# Altium schematic sheet PLWD_GNSS_RF.SchDoc
size A3; SheetNumber: 4; SheetTotal: 11
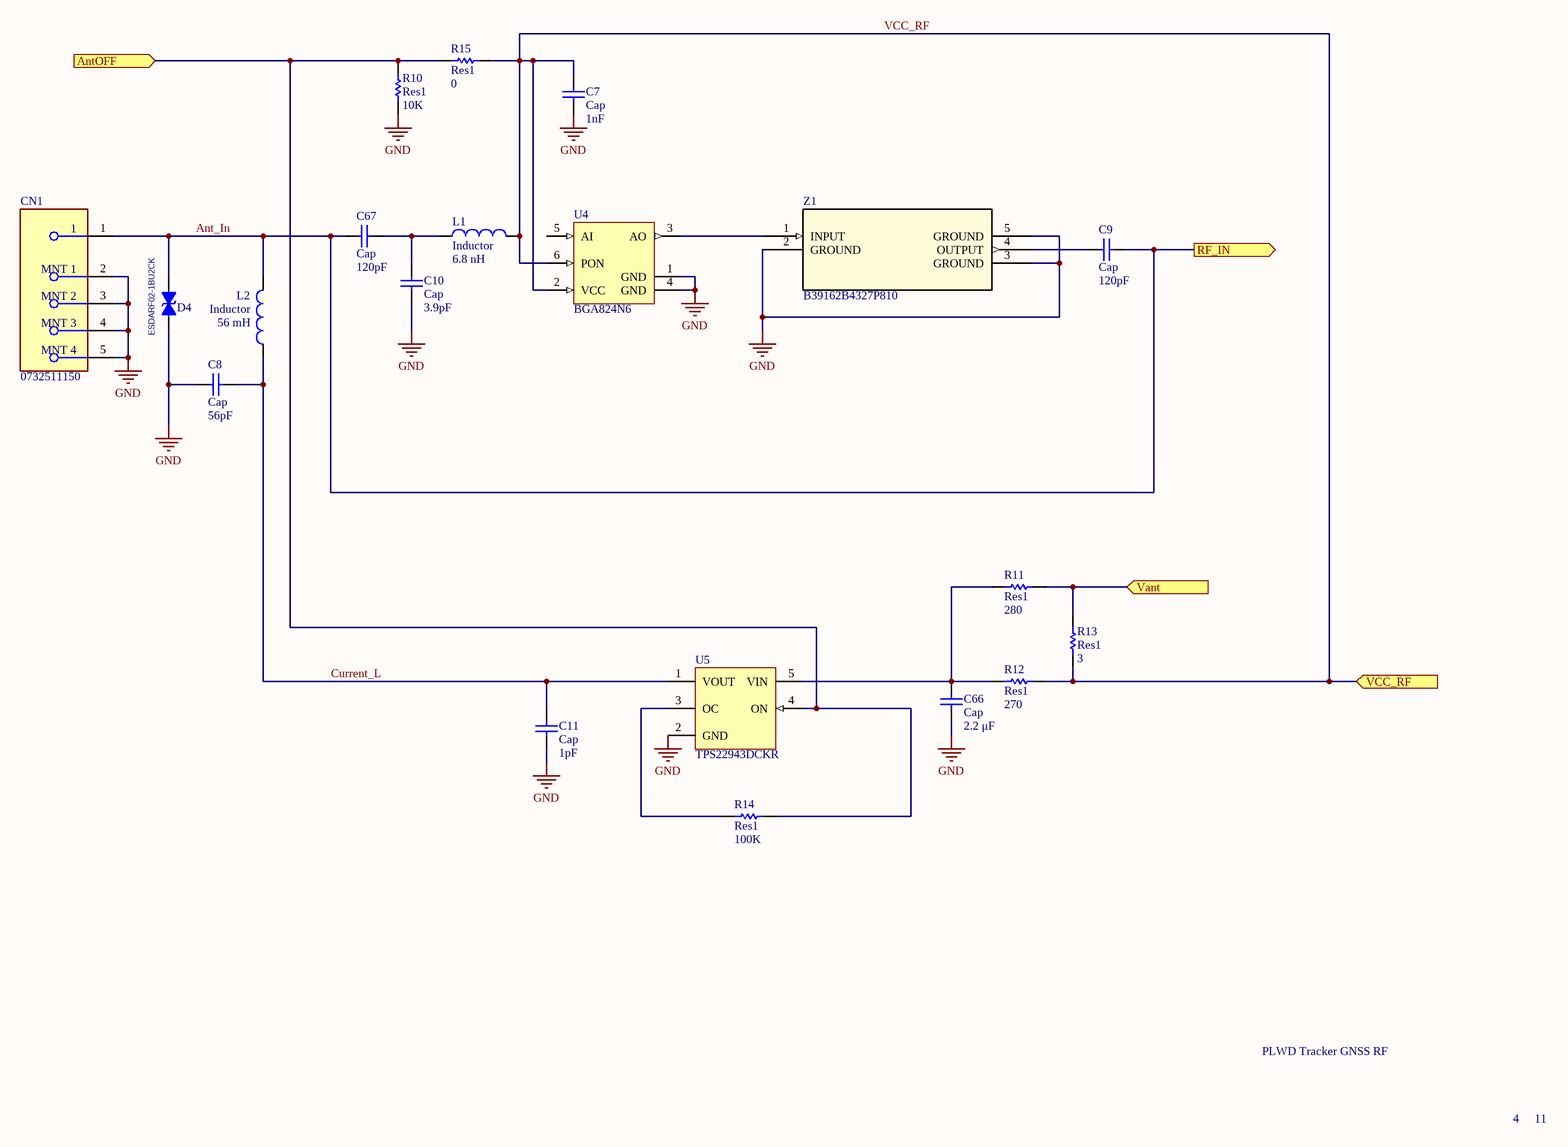
[diagram p0: PLWD_GNSS_RF.SchDoc]

## Parts
C7  Cap  value 1nF  [RAD-0.3]
C8  Cap  value 56pF  [RAD-0.3]
C9  Cap  value 120pF  [RAD-0.3]
C10  Cap  value 3.9pF  [RAD-0.3]
C11  Cap  value 1pF  [RAD-0.3]
C66  Cap  value 2.2 μF  [RAD-0.3]
C67  Cap  value 120pF  [RAD-0.3]
CN1  0732511150  [FP-0732511150-MFG]
D4  ESDARF02-1BU2CK  [ST_0201B]
L1  Inductor  value 6.8 nH  [0402-A]
L2  Inductor  value 56 mH  [0402-A]
R10  Res1  value 10K  [AXIAL-0.3]
R11  Res1  value 280  [AXIAL-0.3]
R12  Res1  value 270  [AXIAL-0.3]
R13  Res1  value 3  [AXIAL-0.3]
R14  Res1  value 100K  [AXIAL-0.3]
R15  Res1  value 0  [AXIAL-0.3]
U4  BGA824N6  [INF-TSNP-6-2_V]
U5  TPS22943DCKR  [DCK0005A_N]
Z1  B39162B4327P810  [B39162B4327P810_TDK]

## Ports
AntOFF (in), RF_IN (out), Vant (in), VCC_RF (in)

## Nets
GND: C7.1 C8.1 C10.1 C11.1 C66.1 CN1.2(MNT_1) CN1.3(MNT_2) CN1.4(MNT_3) CN1.5(MNT_4) D4.1 R10.1 U4.1(GND) U4.4(GND) U5.2(GND) Z1.2(GROUND) Z1.3(GROUND) Z1.5(GROUND)
Ant_In: C9.2 C67.1 CN1.1 D4.2 L2.2 ; port RF_IN
AntOFF: R10.2 R14.2 R15.1 U5.4(ON) ; port AntOFF
Current_L: C8.2 C11.2 L2.1 U5.1(VOUT)
Vant: R11.2 R13.2 ; port Vant
VCC_RF: C7.2 L1.2 R12.2 R13.1 R15.2 U4.2(VCC) U4.6(PON) ; port VCC_RF
NetC9_1: C9.1 Z1.4(OUTPUT)
NetC10_2: C10.2 C67.2 L1.1
NetC66_2: C66.2 R11.1 R12.1 U5.5(VIN)
NetR14_1: R14.1 U5.3(OC)
NetU4_3: U4.3(AO) Z1.1(INPUT)

Not connected (* = marked no-connect by the designer): U4 5(AI)

## Notes on the sheet
- PLWD Tracker GNSS RF
- 4
- 11

## Library data of the parts
C7-C11 C66 C67 = Cap: Capacitor; Published: 8-Jun-2000; LatestRevisionDate: 17-Jul-2002; LatestRevisionNote: Re-released for DXP Platform.; PackageReference: RAD-0.3; Publisher: Altium Limited; PackageDescription: Radial Cap, Thru-Hole; 2 Leads; 0.3 in Pin Spacing
CN1 = CMP-04764-000001-1: CONN SMA RCPT STR 50OHM EDGE MNT; Manufacturer: Molex Inc; Voltage Rating: 500V; Is Female: yes; Impedance: 50Ω; Conn Orientation: Horizontal; Dielectric Material: PTFE; Frequency: 18GHz; Shielding: true; Number Of Contacts: 1; Temperature: -65°C to +165°C; Device Class L2: RF / Coaxial Connectors; Contact Material: Gold,Nickel; RoHS: TRUE; ComponentLink2Description: Datasheet; Digikey Description: CONN SMA RCPT STR 50OHM EDGE MNT; Category: Conn; Package: 0; Device Class L1: Connectors; Manufacturer Part Number: 0732511150; Temperature Range High: +165°C; Mouser Description: RF Connectors / Coaxial Connectors SMA ST PCB-JCK STD EMT; Footprint Url: https://www.molex.com/pdm_docs/sd/732511150_sd.pdf; Octopart: https://octopart.com/73251-1150-molex-777272; Automotive: No; Lead Free: Yes; Temperature Range Low: -65°C; ComponentLink2URL: https://www.molex.com/webdocs/datasheets/pdf/en-us/0732511150_RF_COAX_CONNECTORS.pdf; Device Class L3: unset
L1 L2 = Inductor: Code_IEC: 1005; Published: 8-Jun-2000; LatestRevisionDate: 29-May-2009; LatestRevisionNote: IPC-7351 Footprint Added.; PackageReference: 0402-A; Publisher: Altium Limited; PackageDescription: Chip Inductor; Code_JEITA: 0402
R10-R15 = Res1: Resistor; Published: 8-Jun-2000; LatestRevisionDate: 17-Jul-2002; LatestRevisionNote: Re-released for DXP Platform.; PackageReference: AXIAL-0.3; Publisher: Altium Limited; PackageDescription: Axial Device, Thru-Hole; 2 Leads; 0.3 in Pin Spacing
U4 = CMP-1210-00004-1: Silicon Germanium Low Noise Amplifier for Global Navigation Satellite Systems (GNSS), -40 to 85 degC, TSNP-6, Reel, Green; Manufacturer: Infineon; P-1dB (in): -6; F (typ): 0.55Â dB; Green: TRUE; I (typ): 3.9Â mA; Frequency: 1550 to 1615 MHz; Gain (typ): 17Â dB; Halogen-free: TRUE; ComponentLink2Description: Datasheet; ComponentLink1URL: http://www.infineon.com/; PartNumber: BGA824N6; PackageVersion: Jan-13; PackageReference: TSNP-6-2; Packing: Reel; ComponentLink3URL: http://www.infineon.com/dgdl/TSNP-6-2-Package_Overview.pdf?folderId=db3a304327b89750012805e1379a6124&fileId=db3a30433c6612b1013c6bcb02293ba1; PackageDescription: 6-Pin Thin Small Non Leaded Package, 1.1 x 0.7 mm Body, 0.4 mm Pitch; ComponentLink1Description: Manufacturer URL; ComponentLink2URL: http://www.infineon.com/dgdl/BGA824N6.pdf?folderId=db3a30431f848401011fcbf2ab4c04c4&fileId=db3a30433f764301013f7b53cdd02721; ComponentLink3Description: Package Specification; Mounting Technology: Surface Mount; DatasheetVersion: Rev. 3.0
U5 = CMP-0329-00079-2: Low-Input Voltage 40 mA Current Limited Load Switch, 400 mOhms rDS(On), -40 to 85 degC, 5-pin SC70 (DCK), Green (RoHS & no Sb/Br); Manufacturer: Texas Instruments; SubFamily: Current Limited Switch; Vin(Min)(V): 1.62; Number of FETs: 1; Adjustable Current Limit(Min)(A): 0.04; Enable/Shutdown: Active High; Vin(Max)(V): 5.5; rDS(on) per FET(Typ)(mOhms): 400; Iq(Typ)(uA): 40; PackageReference: DCK0005A; PackageDescription: 5-Pin Plastic Small-Outline Package, 2 x 1.3 mm Body, 0.65 mm Pitch, 2.1 mm Lead Span; DatasheetVersion: SLVS832C; ComponentLink1URL: http://www.ti.com/general/docs/lit/getliterature.tsp?genericPartNumber=TPS22943&fileType=pdf; Mounting Technology: Surface Mount; Code_JEDEC: MO-203-AA; PartNumber: TPS22943DCKR; PackageVersion: revG, Jan-2007; Eco-Plan: Green (RoHS & no Sb/Br); ComponentLink1Description: Datasheet
Z1 = B39162B4327P810: No Description Available; Mfr_Name: TDK; Copyright: Copyright (C) 2022 Ultra Librarian. All rights reserved.; Manufacturer_Part_Number: B39162B4327P810; RefDes: RefDes; Type: DEV